# EAGLE schematic Jeep_Windshield_and_Grill_Light (EAGLE 8.5.0)
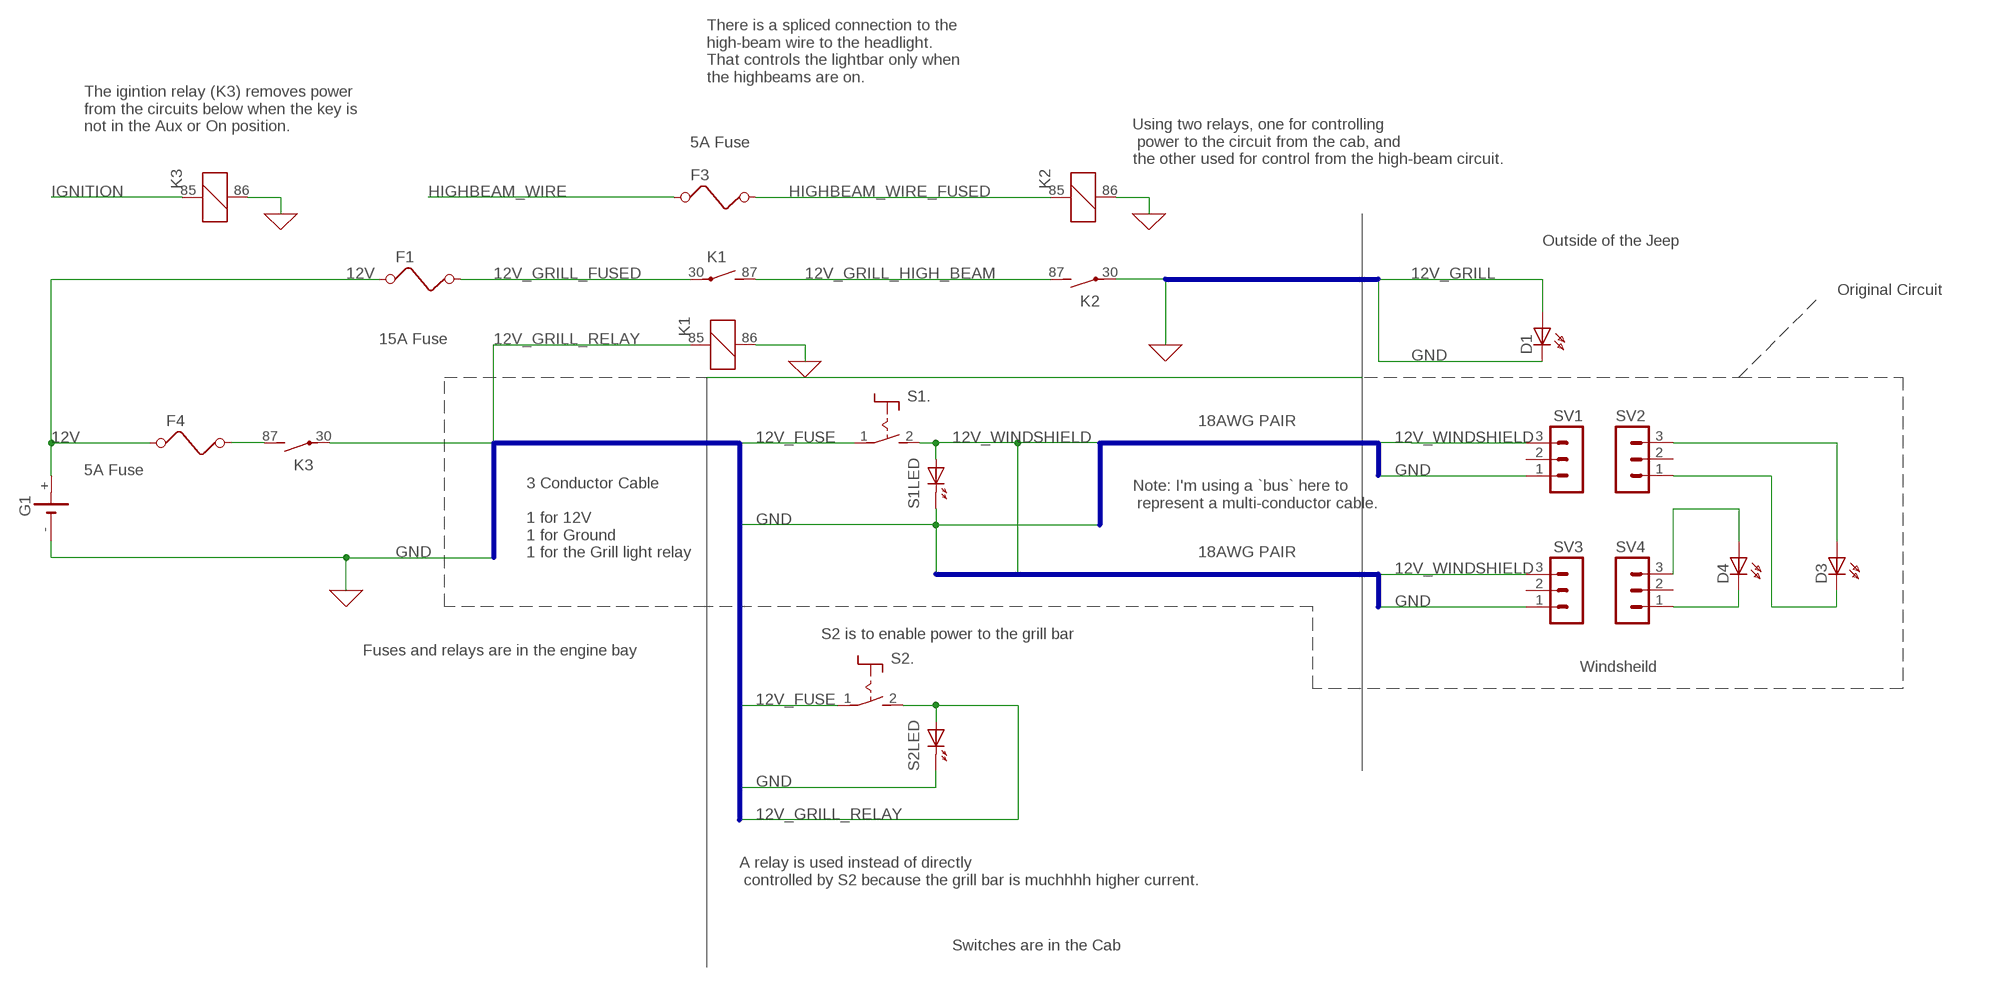
[diagram p0: schematic, sheet 1]

## Parts
D1  HLMP6  [HLMP6]
D3  HLMP6  [HLMP6]
D4  HLMP6  [HLMP6]
F1  FUSE  [FUSE]
F3  FUSE  [FUSE]
F4  FUSE  [FUSE]
G1  SL340B  [SL-340/B3.6V]
K1  CM1A-P-12V  [CM]
K2  CM1A-P-12V  [CM]
K3  CM1A-P-12V  [CM]
S1  MARQ6425  [MARQ6425]
S2  MARQ6425  [MARQ6425]
SV1  MA03-1  [MA03-1]
SV2  MA03-1  [MA03-1]
SV3  MA03-1  [MA03-1]
SV4  MA03-1  [MA03-1]

## Nets
0: K1.86 K2.86 K3.86 ; supply symbol labelled GND
12V: F1.1 F4.1 G1.+
12V_FUSE: K3.30(2:P) S1.1(.:P) S2.1(.:P)
12V_GRILL: D1.A K2.30(2:P)
12V_GRILL_FUSED: F1.2 K1.30(2:P)
12V_GRILL_HIGH_BEAM: K1.87(2:S) K2.87(2:S)
12V_GRILL_RELAY: K1.85 S2.2(.:S) S2.A(LED:A)
12V_WINDSHIELD: S1.2(.:S) S1.A(LED:A) SV1.3 SV3.3
GND: D1.K G1.- S1.K(LED:K) S2.K(LED:K) SV1.1 SV3.1
HIGHBEAM_WIRE: F3.1
HIGHBEAM_WIRE_FUSED: F3.2 K2.85
IGNITION: K3.85
N$2: D4.A SV4.3
N$3: D3.A SV2.3
N$4: D4.K SV4.1
N$5: D3.K SV2.1
N$6: F4.2 K3.87(2:S)
Unconnected: SV1.2 SV2.2 SV3.2 SV4.2

## Buses
12V_WINDSHIELD,GND
12V_FUSE,GND,12V_GRILL_RELAY
12V_GRILL,GND

## Notes on the sheet
- There is a spliced connection to the 
  high-beam wire to the headlight. 
  That controls the lightbar only when
  the highbeams are on.
- The igintion relay (K3) removes power 
  from the circuits below when the key is 
  not in the Aux or On position.
- 5A Fuse
- Using two relays, one for controlling
   power to the circuit from the cab, and 
  the other used for control from the high-beam circuit.
- Outside of the Jeep
- Original Circuit
- 15A Fuse
- 18AWG PAIR
- 5A Fuse
- Note: I'm using a `bus` here to
   represent a multi-conductor cable.
- 3 Conductor Cable
  
  1 for 12V
  1 for Ground
  1 for the Grill light relay
- 18AWG PAIR
- S2 is to enable power to the grill bar
- Fuses and relays are in the engine bay
- Windsheild
- A relay is used instead of directly
   controlled by S2 because the grill bar is muchhhh higher current.
- Switches are in the Cab

## Library data of the parts
D1 D3 D4 = display-hp:HLMP6: LED 2mm horizontal; MF: AGILENT TECHNOLOGIES; MPN: HLMP-6500; OC_FARNELL: 1652490; OC_NEWARK: 40K0088
F1 F3 F4 = special:FUSE: FUSE 5 x 20 mm
G1 = battery:SL340B: LI BATTERY Sonnenschein SL-340 B 3.6 V
K1-K3 = relay:CM1A*: AUTOMOTIVE MICRO-ISO RELAY NAiS en_ds_61204_0000.pdf; MF: AROMAT/ MATSUSHITA; MPN: CM1A-P-12V; OC_FARNELL: unknown; OC_NEWARK: 10C5491
S1 S2 = switch:MARQ6425: DIL SWITCH with LED, Marquardt
SV1-SV4 = con-lstb:MA03-1: PIN HEADER; OC_FARNELL: unknown; OC_NEWARK: unknown